# EAGLE design optical_sensor_prototype (EAGLE 6.1)
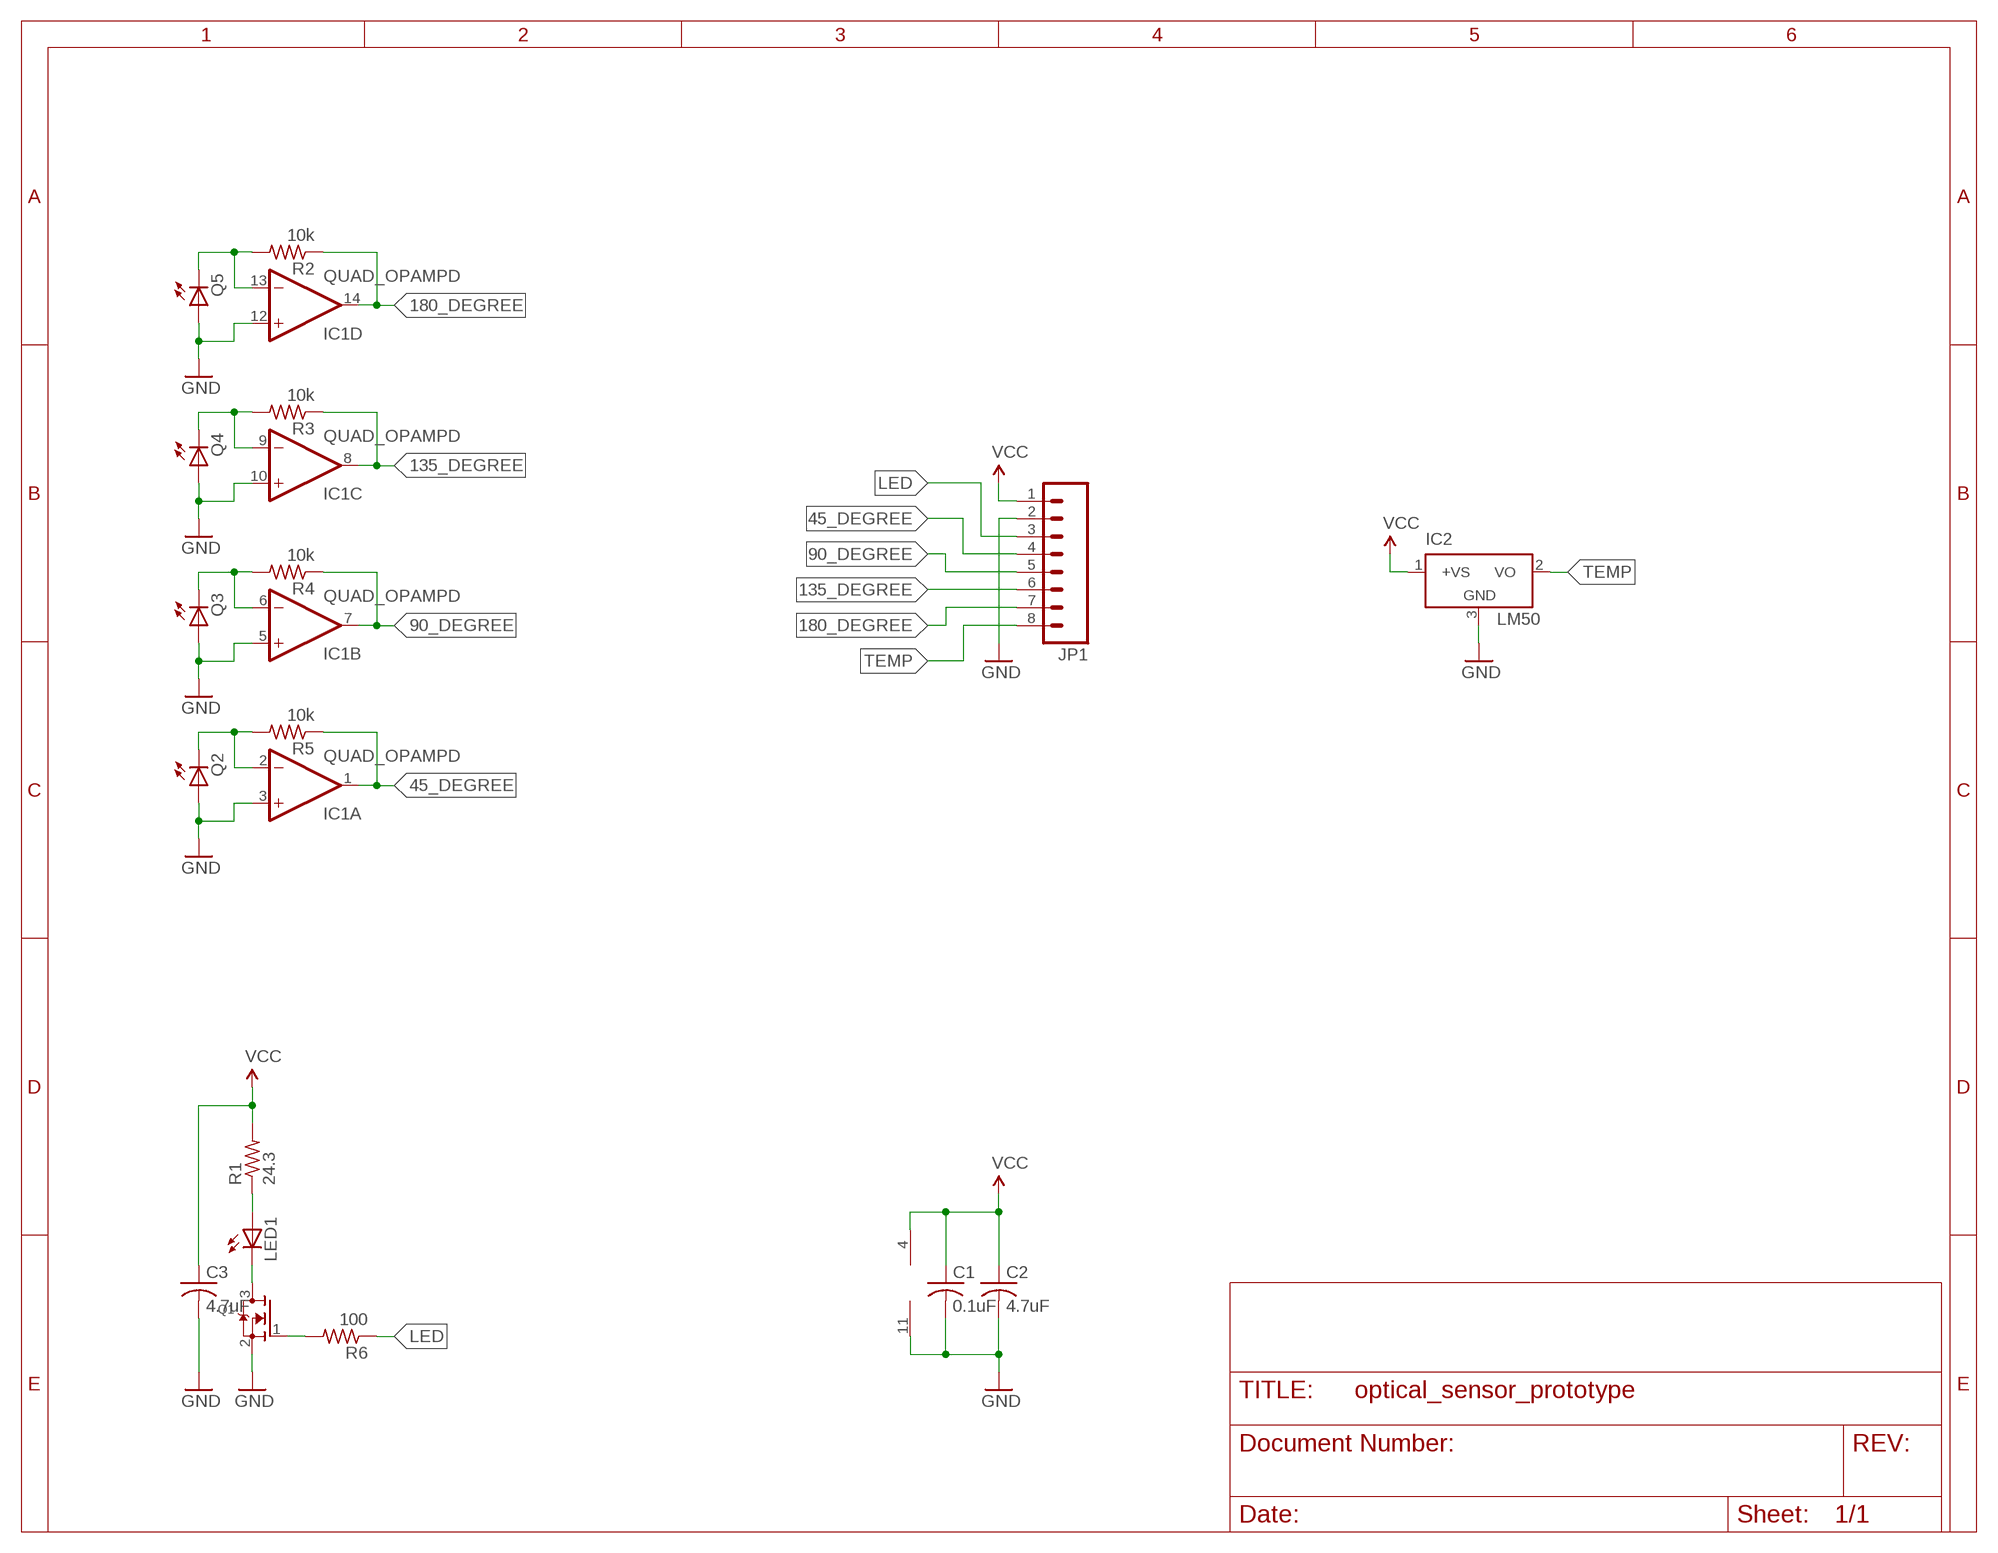
[diagram p0: schematic, sheet 1]

## Parts
C1  0.1uF  C-USC1206  [C1206]
C2  4.7uF  C-USC1206  [C1206]
C3  4.7uF  C-USC1206  [C1206]
IC1  QUAD_OPAMPD  [SO14]
IC2  LM50  [SOT23]
JP1  M081X08  [1X08]
LED1  LEDSMT1206  [1206]
Q1  MOSFET-NREFLOW  [SOT23]
Q2  LEDSMT1206  [1206]
Q3  LEDSMT1206  [1206]
Q4  LEDSMT1206  [1206]
Q5  LEDSMT1206  [1206]
R1  24.3  R-US_R1206  [R1206]
R2  10k  R-US_R1206  [R1206]
R3  10k  R-US_R1206  [R1206]
R4  10k  R-US_R1206  [R1206]
R5  10k  R-US_R1206  [R1206]
R6  100  R-US_R1206  [R1206]

## Nets
45_DEGREE: IC1.1(A:OUT) JP1.4 R5.1
90_DEGREE: IC1.7(B:OUT) JP1.5 R4.1
135_DEGREE: IC1.8(C:OUT) JP1.6 R3.1
180_DEGREE: IC1.14(D:OUT) JP1.7 R2.1
GND: C1.2 C2.2 C3.2 IC1.3(A:+IN) IC1.5(B:+IN) IC1.10(C:+IN) IC1.11(P:V-) IC1.12(D:+IN) IC2.3(GND) JP1.2 Q1.2(S) Q2.A Q3.A Q4.A Q5.A
LED: JP1.3 R6.1
N$1: LED1.A R1.1
N$2: IC1.2(A:-IN) Q2.C R5.2
N$3: LED1.C Q1.3(D)
N$4: Q1.1(G) R6.2
N$5: IC1.6(B:-IN) Q3.C R4.2
N$7: IC1.13(D:-IN) Q5.C R2.2
N$9: IC1.9(C:-IN) Q4.C R3.2
TEMP: IC2.2(VO) JP1.8
VCC: C1.1 C2.1 C3.1 IC1.4(P:V+) IC2.1(+VS) JP1.1 R1.2

## Library data of the parts
C1-C3 = adafruit:C-US: CAPACITOR, American symbol
IC1 = adafruit:QUAD_OPAMP: OP AMP Standard quad package
IC2 = linear:LM50: SOT-23 Single-Supply Centigrade Temperature Sensor Vout = (10mV/°C x Temp °C) +5mmmV Source: http://cache.national.com/ds/LM/LM50.pdf
JP1 = sparkfun:M08: Header 8 Standard 8-pin 0.1" header. Use with straight break away headers (SKU : PRT-00116), right angle break away headers (PRT-00553), swiss pins (PRT-00743), machine pins (PRT-00117), and female headers (PRT-00115).
LED1 Q2-Q5 = adafruit:LED: LED OSRAM: - CHIPLED LG R971, LG N971, LY N971, LG Q971, LY Q971, LO R971, LY R971 LH N974, LH R974 LS Q976, LO Q976, LY Q976 LO Q996 - Hyper CHIPLED LW Q18S LB Q993, LB Q99A, LB R99A - SideLED LS A670, LO A670, LY A670, LG A670, LP A670 LB A673, LV A673, LT A673, LW A673 LH A674 LY A675 LS A676, LA A676, LO A676, LY A676, LW A676 LS A679, LY A679, LG A679 - Hyper Micro SIDELED® LS Y876, LA Y876, LO Y876, LY Y876 LT Y87S - SmartLED LW L88C, LW L88S LB L89C, LB L89S, LG L890 LS L89K, LO L89K, LY L89K LS L896, LA L896, LO L896, LY L896 - TOPLED LS T670, LO T670, LY T670, LG T670, LP T670 LSG T670, LSP T670, LSY T670, LOP T670, LYG T670 LG T671, LOG T671, LSG T671 LB T673, LV T673, LT T673, LW T673 LH T674 LS T676, LA T676, LO T676, LY T676, LB T676, LH T676, LSB T676, LW T676 LB T67C, LV T67C, LT T67C, LS T67K, LO T67K, LY T67K, LW E67C LS E67B, LA E67B, LO E67B, LY E67B, LB E67C, LV E67C, LT E67C LW T67C LS T679, LY T679, LG T679 LS T770, LO T770, LY T770, LG T770, LP T770 LB T773, LV T773, LT T773, LW T773 LH T774 LS E675, LA E675, LY E675, LS T675 LS T776, LA T776, LO T776, LY T776, LB T776 LHGB T686 LT T68C, LB T68C - Hyper Mini TOPLED® LB M676 - Mini TOPLED Santana® LG M470 LS M47K, LO M47K, LY M47K Source: http://www.osram.convergy.de/
Q1 = adafruit:MOSFET-N: N-Channel Mosfet 2N7002E - 60V 260mA SOT23 [Digikey: 2N7002ET1GOSTR-ND] - REEL BSH103 - 30V 850mA SOT23 [Digikey: 568-5013-1-ND]
R1-R6 = adafruit:R-US_: RESISTOR, American symbol

## Board
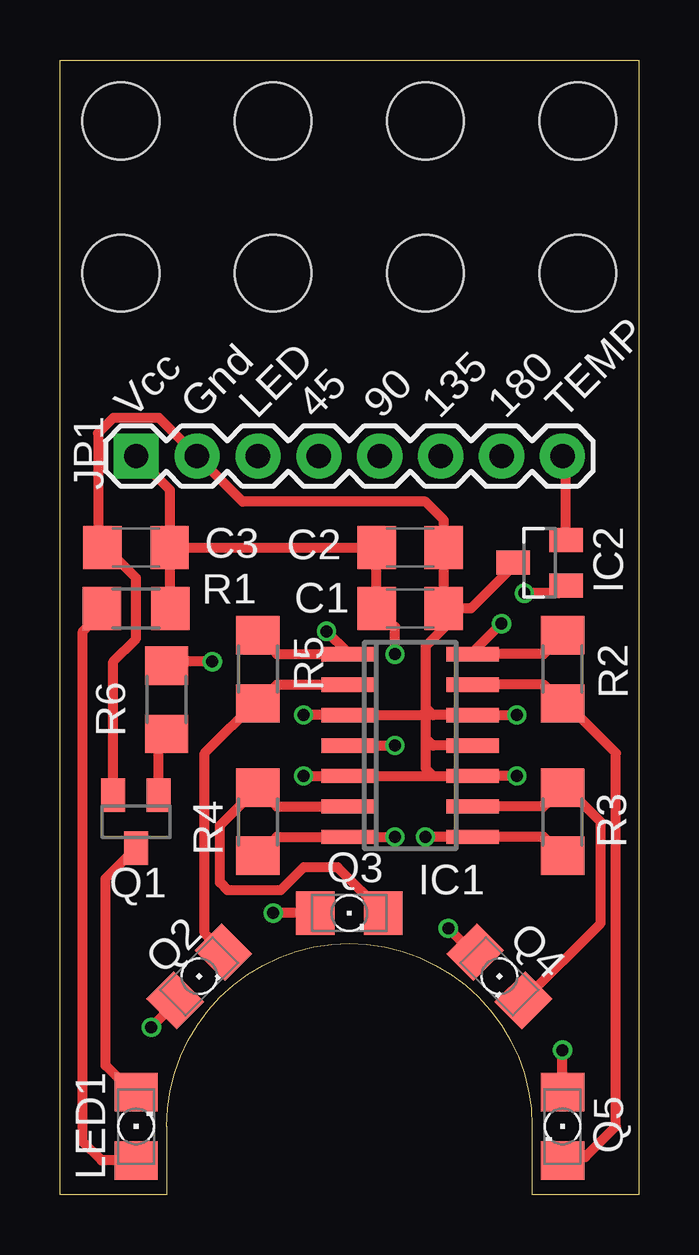
[diagram p1: board, top side]
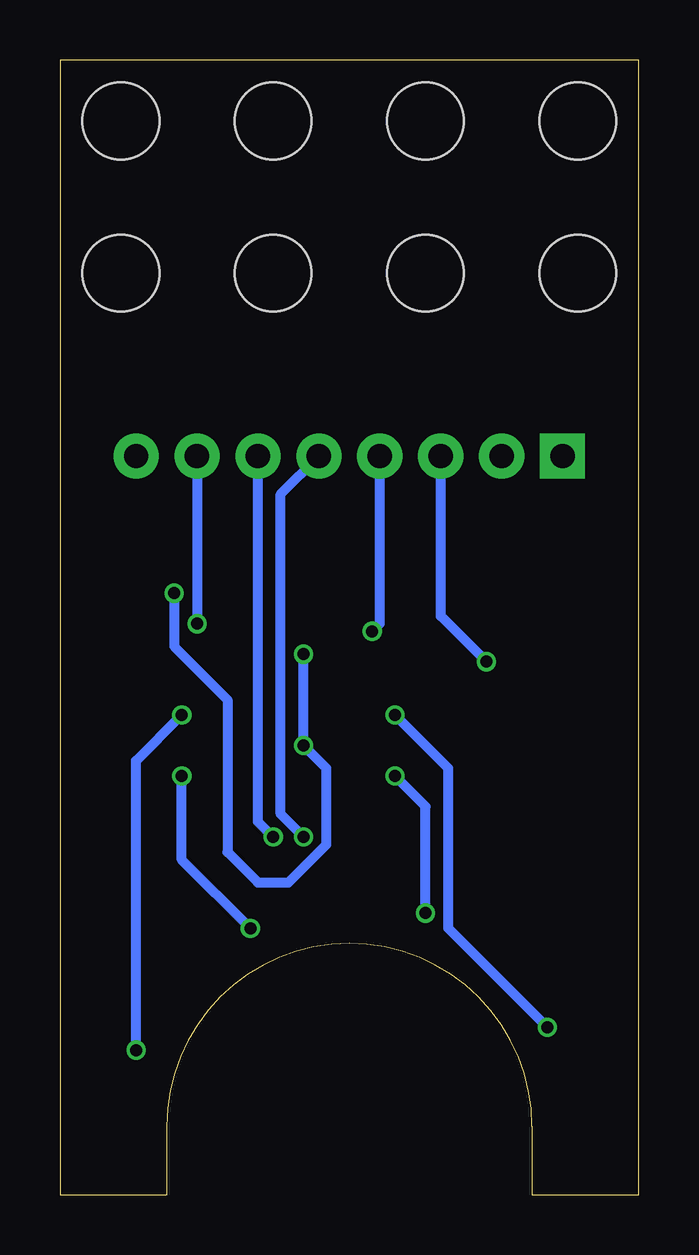
[diagram p2: board, bottom side, seen from below]

Size 24.13 x 47.31 mm. Coordinates in mm from the lower left corner, seen from the top.
Outline: 4.44,0 0,0 0,47.31 24.13,47.31 24.13,0 19.68,0 19.68,2.86 arc180 4.44,2.86 4.44,0
Copper layers (1*16): Top 0.035mm / dielectric 1.5mm / Bottom 0.035mm
Design rules: minimum track width 6mil, minimum drill 12mil, track to track 6mil, track to pad 6mil, pad to pad 6mil, via to via 6mil, smd to smd 0mil, copper to edge 10mil, drill to drill 10mil, minimum pad ring 10mil, minimum via ring 6mil, stop-mask expansion 2mil, vias tented up to drill 100mil, thermal gap 10mil
Holes 3.2 mm at 2.54,44.77 8.89,44.77 15.24,44.77 21.59,44.77 2.54,38.42 8.89,38.42 15.24,38.42 21.59,38.42

### Footprints (pad centres in the part's own frame; a part is rotated, then mirrored left to right if it is on the bottom)
C1206 = smd 1.6 x 1.8: 1 -1.4,0; 2 1.4,0
SO14 = smd 0.6 x 2.2: 1 -3.81,-2.6; 2 -2.54,-2.6; 3 -1.27,-2.6; 4 0,-2.6; 5 1.27,-2.6; 6 2.54,-2.6; 7 3.81,-2.6; 8 3.81,2.6; 9 2.54,2.6; 10 1.27,2.6; 11 0,2.6; 12 -1.27,2.6; 13 -2.54,2.6; 14 -3.81,2.6
SOT23 = smd 1 x 1.4: 1 -0.95,-1.1; 2 0.95,-1.1; 3 0,1.1
1X08 = drill 1.016 pad 1.88 square: 1 0,0 | drill 1.016 pad 1.88: 2 2.54,0; 3 5.08,0; 4 7.62,0; 5 10.16,0; 6 12.7,0; 7 15.24,0; 8 17.78,0
1206 = smd 1.6 x 1.803: A -1.422,0; C 1.422,0
R1206 = smd 1.6 x 1.803: 1 -1.422,0; 2 1.422,0

### Placement (x,y rotation side)
C1  14.61,24.45 0 top
C2  14.61,26.99 0 top
C3  3.17,26.99 180 top
IC1  14.61,18.73 270 top
IC2  20,26.35 90 top
JP1  3.17,30.8 0 top
LED1  3.17,2.86 90 top
Q1  3.17,15.56 180 top
Q2  5.81,9.11 45 top
Q3  12.06,11.75 0 top
Q4  18.32,9.11 315 top
Q5  20.95,2.86 270 top
R1  3.17,24.45 0 top
R2  20.95,21.91 270 top
R3  20.95,15.56 90 top
R4  8.25,15.56 90 top
R5  8.25,21.91 270 top
R6  4.44,20.64 270 top

### Tracks (layer width: path | path; a pad name or v marks a point on that pad's centre or on a via)
45_DEGREE  (via drill 0.5)
  Top 0.406: R5.1 9.04,22.54 IC1.1 12,22.6 v11.11,23.49
  Bottom 0.406: v11.11,23.49 10.79,23.81 JP1.4
90_DEGREE  (via drill 0.5)
  Top 0.406: R4.1 9.04,14.92 IC1.7 v13.97,14.92
  Bottom 0.406: v13.97,14.92 14.92,15.88 14.92,29.21 JP1.5
135_DEGREE  (via drill 0.5)
  Top 0.406: R3.1 20.17,14.92 IC1.8 v15.24,14.92
  Bottom 0.406: v15.24,14.92 15.88,15.56 JP1.6
180_DEGREE  (via drill 0.5)
  Top 0.406: R2.1 20.17,22.54 IC1.14 17.2,22.6 v18.41,23.81
  Bottom 0.406: JP1.7 v18.41,23.81
GND  (via drill 0.5)
  Top 0.406: v19.05,20 IC1.12 15.56,20 15.24,20.32 | Q5.A v20.95,6.03 | Q4.A 17.18,10.12 v16.19,11.11 | v19.05,17.46 IC1.10 15.56,17.46 | Q3.A v8.89,11.75 | v10.16,17.46 IC1.5 15.56,17.46 | Q2.A 4.8,7.98 v3.81,6.99 | C1.2 16,23.62 15.24,22.86 15.24,20.32 | 15.24,20.32 15.24,20 | 15.24,20 15.24,19.05 | 15.24,19.05 15.24,17.78 15.56,17.46 | IC1.11 15.56,18.73 15.24,19.05 | 15.24,20 IC1.3 v10.16,20 | Q1.2 2.22,22.23 3.17,23.18 3.17,25.72 1.9,26.99 C3.2 1.59,27.17 1.59,31.75 2.22,32.38 4.13,32.38 JP1.2 7.62,28.89 15.24,28.89 16,28.13 C2.2 C1.2 | IC2.3 18.9,26.21 17.14,24.45 C1.2
  Bottom 0.406: v20.95,6.03 20.95,18.1 v19.05,20 | v8.89,11.75 8.89,16.19 v10.16,17.46 | v3.81,6.99 7.94,11.11 7.94,17.78 v10.16,20 | v16.19,11.11 19.05,13.97 v19.05,17.46
LED  (via drill 0.5)
  Top 0.406: v6.35,22.22 4.61,22.22 R6.1
  Bottom 0.406: JP1.3 8.25,24.13 v6.35,22.22
N$1
  Top 0.406: LED1.A 1.74,1.44 0.95,2.22 0.95,23.49 1.75,24.29 1.75,24.3 | 1.75,24.3 1.9,24.45 | R1.1 1.75,24.3
N$2
  Top 0.406: IC1.2 9.04,21.27 R5.2 8.25,20.64 6.03,18.41 6.03,10.9 Q2.C
N$3
  Top 0.406: LED1.C 3.02,4.28 1.9,5.4 1.9,13.19 Q1.3
N$4
  Top 0.406: Q1.1 4.12,18.9 R6.2
N$5
  Top 0.406: IC1.6 9.04,16.19 R4.2 6.67,15.39 6.67,13.02 6.98,12.7 9.21,12.7 10.16,13.65 11.58,13.65 Q3.C
N$7
  Top 0.406: IC1.13 20.17,21.27 R2.2 21.11,20.49 23.18,18.41 23.18,2.86 21.91,1.59 21.11,1.59 Q5.C
N$9
  Top 0.406: IC1.9 20.17,16.19 R3.2 21.12,16.98 22.54,15.56 22.54,11.32 Q4.C
TEMP
  Top 0.406: IC2.2 21.1,30.65 JP1.8
VCC  (via drill 0.5)
  Top 0.406: C3.1 C2.1 C1.1 13.97,23.68 v13.97,22.54 | R1.2 4.6,26.97 C3.1 | JP1.1 4.57,29.4 C3.1 | IC1.4 v13.97,18.73 | IC2.1 20.78,25.08 v19.37,25.08
  Bottom 0.406: v13.97,22.54 v13.97,18.73 13.02,17.78 13.02,14.61 14.61,13.02 15.88,13.02 17.14,14.29 17.14,20.64 19.37,22.86 v19.37,25.08

### Text on the board
_tsilk: Vcc | Gnd | LED | 45 | 90 | 135 | 180 | TEMP